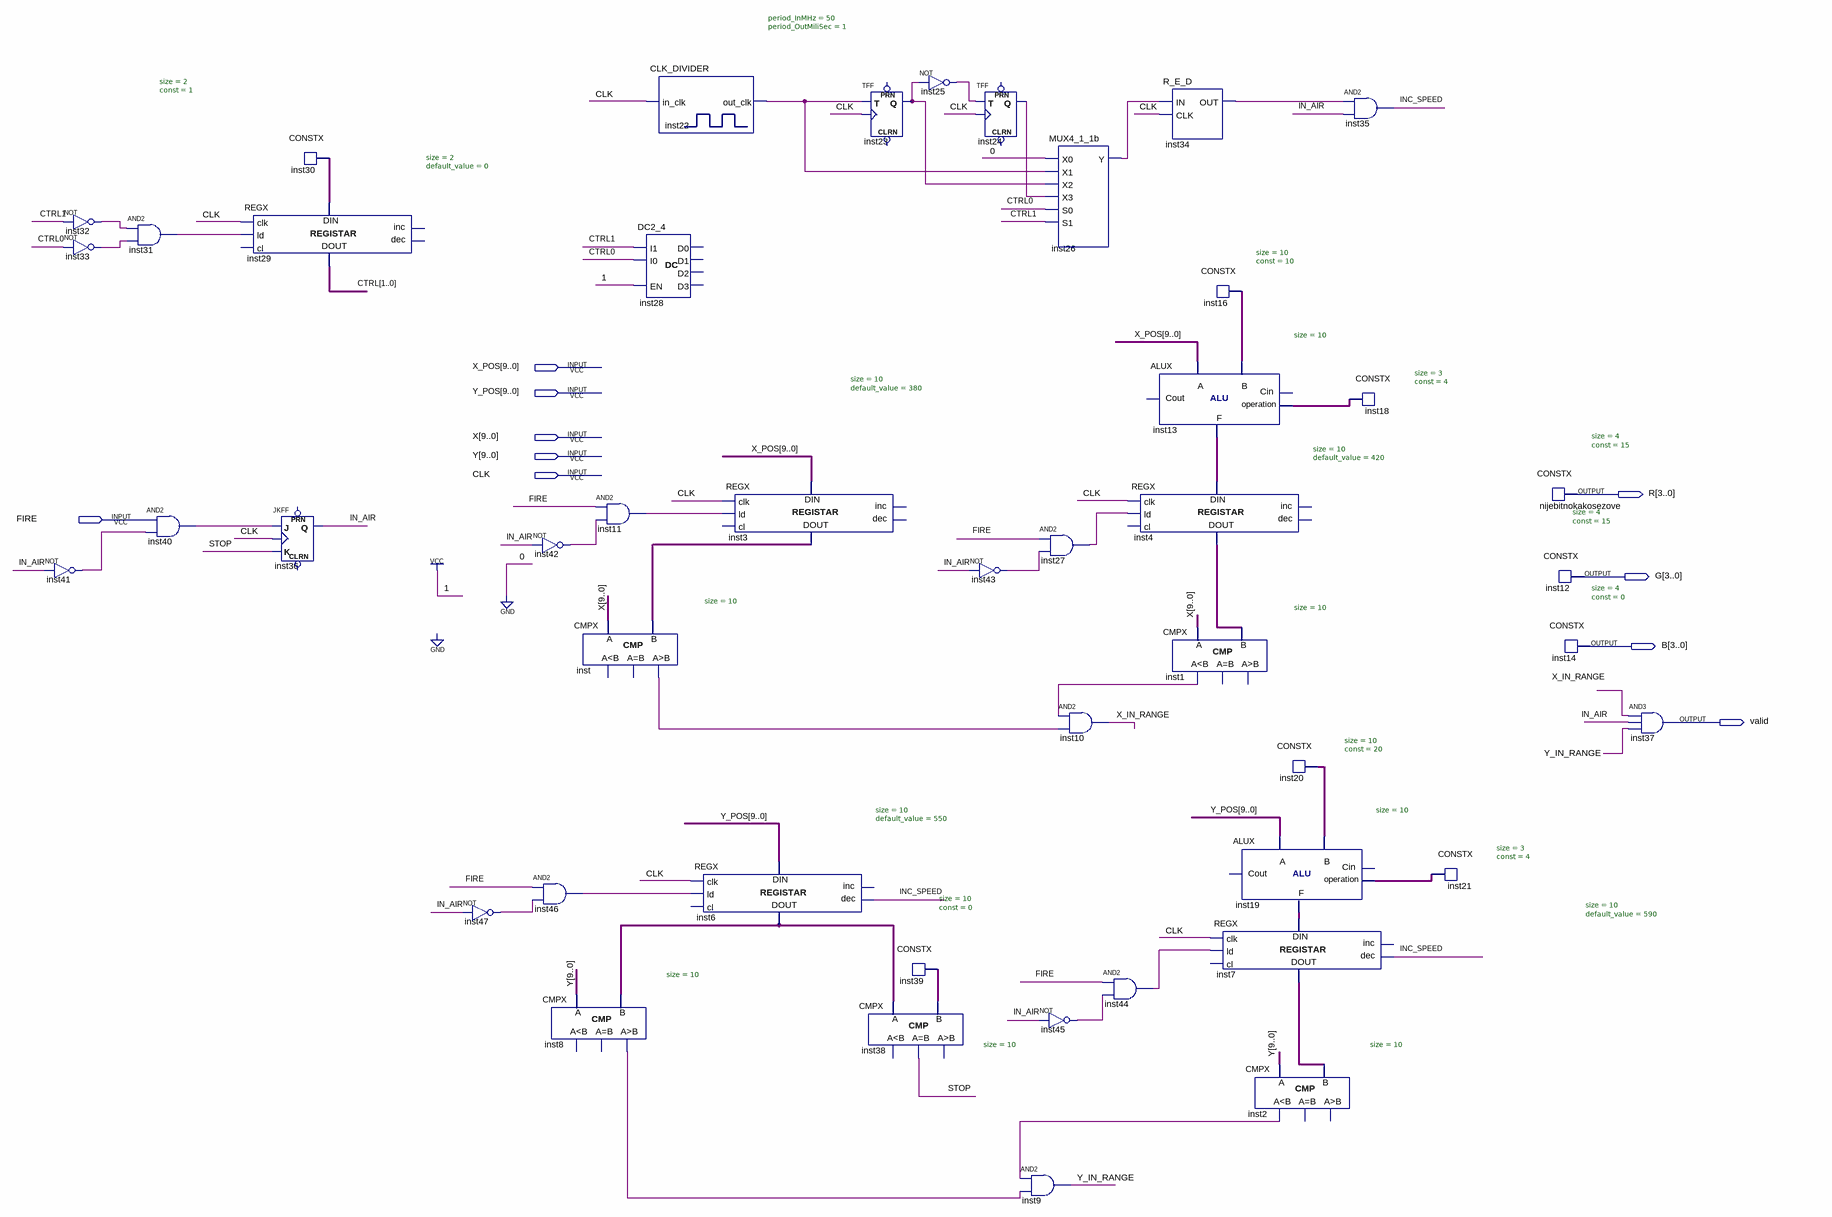
[diagram p0: schematic sheet]
// Quartus schematic metak.bdf as structural Verilog: 46 symbols, 10 pins
module metak (
  input  [9:0] X_POS,
  input  [9:0] Y_POS,
  input  [9:0] X,
  input  [9:0] Y,
  input  CLK,
  input  FIRE,
  output [3:0] R,
  output [3:0] G,
  output [3:0] B,
  output valid
);

  wire IN_AIR, INC_SPEED, inst1_ls, inst2_ls, inst8_gr, inst11_out, inst22_out_clk, inst23_q, inst24_q,
       inst25_out, inst26_y, inst27_out, inst31_out, inst32_out, inst33_out, inst34_out, inst40_out,
       inst41_out, inst42_out, inst43_out, inst44_out, inst45_out, inst46_out, inst47_out, inst_gr, STOP,
       X_IN_RANGE, Y_IN_RANGE;
  wire [1:0] CTRL, inst30_data;
  wire [2:0] inst18_data, inst21_data;
  wire [9:0] inst3_data_out, inst4_data_out, inst6_data_out, inst7_data_out, inst13_f, inst16_data, inst19_f,
       inst20_data, inst39_data;

  not inst41 (inst41_out, IN_AIR);
  not inst32 (inst32_out, CTRL[1]);
  not inst33 (inst33_out, CTRL[0]);
  and inst31 (inst31_out, inst32_out, inst33_out);
  and inst40 (inst40_out, FIRE, inst41_out);
  REGX #(.size(2), .default_value(0)) inst29 (
    .clk(CLK), .ld(inst31_out), .data_in(inst30_data), .data_out(CTRL));  // open: cl, inc, dec
  CONSTX #(.size(2), .\const (1)) inst30 (.data(inst30_data));
  JKFF inst36 (.K(STOP), .J(inst40_out), .CLK(CLK), .Q(IN_AIR));  // open: PRN, CLRN
  not inst47 (inst47_out, IN_AIR);
  not inst42 (inst42_out, IN_AIR);
  and inst46 (inst46_out, FIRE, inst47_out);
  CMPX #(.size(10)) inst8 (.A(Y), .B(inst6_data_out), .gr(inst8_gr));  // open: ls, eq
  and inst11 (inst11_out, FIRE, inst42_out);
  CMPX #(.size(10)) inst (.A(X), .B(inst3_data_out), .gr(inst_gr));  // open: ls, eq
  CLK_DIVIDER #(.period_InMHz(50), .period_OutMiliSec(1)) inst22 (.in_clk(CLK), .out_clk(inst22_out_clk));
  DC2_4 inst28 (.I0(CTRL[0]), .I1(CTRL[1]), .EN(1'b1));  // open: D0, D1, D2, D3
  REGX #(.size(10), .default_value(550)) inst6 (
    .clk(CLK), .ld(inst46_out), .dec(INC_SPEED), .data_in(Y_POS), .data_out(inst6_data_out));  // open: cl, inc
  REGX #(.size(10), .default_value(380)) inst3 (
    .clk(CLK), .ld(inst11_out), .data_in(X_POS), .data_out(inst3_data_out));  // open: cl, inc, dec
  CMPX #(.size(10)) inst38 (.A(inst6_data_out), .B(inst39_data), .eq(STOP));  // open: ls, gr
  TFF inst23 (.T(inst22_out_clk), .CLK(CLK), .Q(inst23_q));  // open: PRN, CLRN
  CONSTX #(.size(10), .\const (0)) inst39 (.data(inst39_data));
  not inst25 (inst25_out, inst23_q);
  TFF inst24 (.T(inst25_out), .CLK(CLK), .Q(inst24_q));  // open: PRN, CLRN
  not inst43 (inst43_out, IN_AIR);
  MUX4_1_1b inst26 (
    .X0(1'b0), .X1(inst22_out_clk), .X2(inst23_q), .X3(inst24_q), .S0(CTRL[0]), .S1(CTRL[1]), .Y(inst26_y));
  and inst27 (inst27_out, FIRE, inst43_out);
  and inst10 (X_IN_RANGE, inst1_ls, inst_gr);
  not inst45 (inst45_out, IN_AIR);
  and inst9 (Y_IN_RANGE, inst2_ls, inst8_gr);
  and inst44 (inst44_out, FIRE, inst45_out);
  R_E_D inst34 (.IN(inst26_y), .CLK(CLK), .OUT(inst34_out));
  ALUX #(.size(10)) inst13 (.B(inst16_data), .A(X_POS), .op(inst18_data), .F(inst13_f));  // open: Cin, Cout
  REGX #(.size(10), .default_value(420)) inst4 (
    .clk(CLK), .ld(inst27_out), .data_in(inst13_f), .data_out(inst4_data_out));  // open: cl, inc, dec
  CMPX #(.size(10)) inst1 (.A(X), .B(inst4_data_out), .ls(inst1_ls));  // open: eq, gr
  CONSTX #(.size(10), .\const (10)) inst16 (.data(inst16_data));
  REGX #(.size(10), .default_value(590)) inst7 (
    .clk(CLK), .ld(inst44_out), .dec(INC_SPEED), .data_in(inst19_f), .data_out(inst7_data_out));  // open: cl, inc
  ALUX #(.size(10)) inst19 (.B(inst20_data), .A(Y_POS), .op(inst21_data), .F(inst19_f));  // open: Cin, Cout
  CMPX #(.size(10)) inst2 (.A(Y), .B(inst7_data_out), .ls(inst2_ls));  // open: eq, gr
  CONSTX #(.size(10), .\const (20)) inst20 (.data(inst20_data));
  and inst35 (INC_SPEED, inst34_out, IN_AIR);
  CONSTX #(.size(3), .\const (4)) inst18 (.data(inst18_data));
  CONSTX #(.size(3), .\const (4)) inst21 (.data(inst21_data));
  CONSTX #(.size(4), .\const (15)) nijebitnokakosezove (.data(R));
  CONSTX #(.size(4), .\const (15)) inst12 (.data(G));
  CONSTX #(.size(4), .\const (0)) inst14 (.data(B));
  and inst37 (valid, X_IN_RANGE, IN_AIR, Y_IN_RANGE);
endmodule
